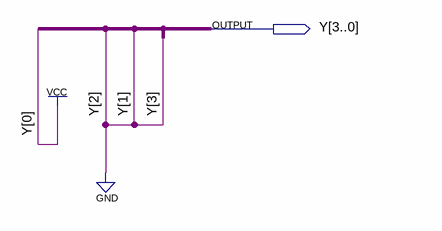
[diagram p0: schematic sheet]
// Quartus schematic Const_1_4bit.bdf as structural Verilog: 0 symbols, 1 pins
module Const_1_4bit (
  output [3:0] Y
);


  assign Y = 4'b0001;
endmodule
